# EAGLE design Charger Relay Board rev2 (EAGLE 9.5.0)
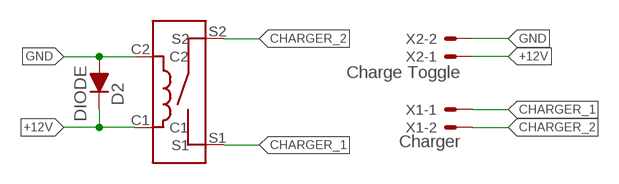
[diagram p0: schematic, sheet 1]

## Parts
D2  DIODE  DIODE0805  [0805_D]
U$1  KT12-1A-40L-THT  [KT12-1A-40L-THT]
X1  Charger  CONNECTOR-2  [MINIFIT_5566-2]
X2  Charge Toggle  CONNECTOR-2  [MINIFIT_5566-2]

## Nets
+12V: D2.C U$1.C1 X2.1
CHARGER_1: U$1.S1 X1.1
CHARGER_2: U$1.S2 X1.2
GND: D2.A U$1.C2 X2.2

## Library data of the parts
D2 = HyTechDevices:DIODE: DIODE general purpose rectifier
U$1 = HyTechDevices:KT12-1A-40L-THT
X1 X2 = HyTechDevices:CONNECTOR-2: Mini-Fit Junior connector 2 pole Source: http://www.molex.com; OC_FARNELL: 1822072; OC_NEWARK: unknown

## Board
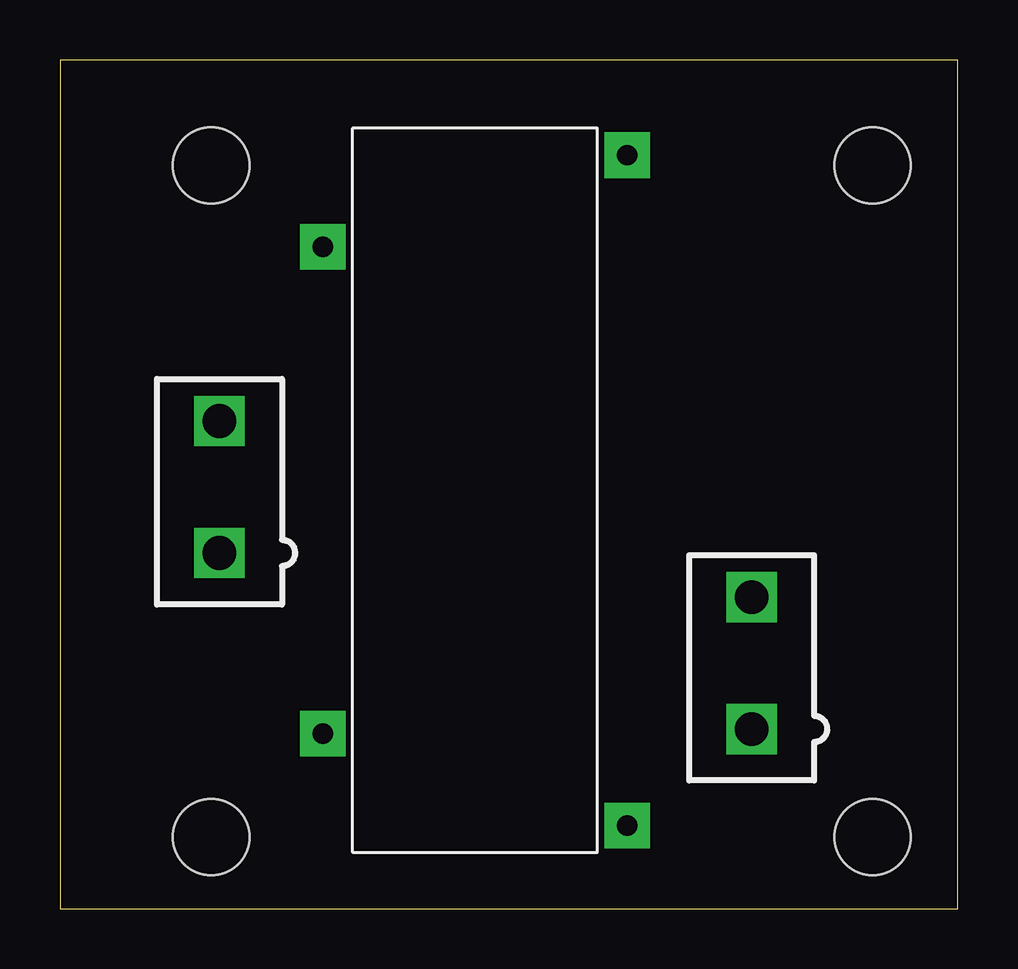
[diagram p1: board, top side]
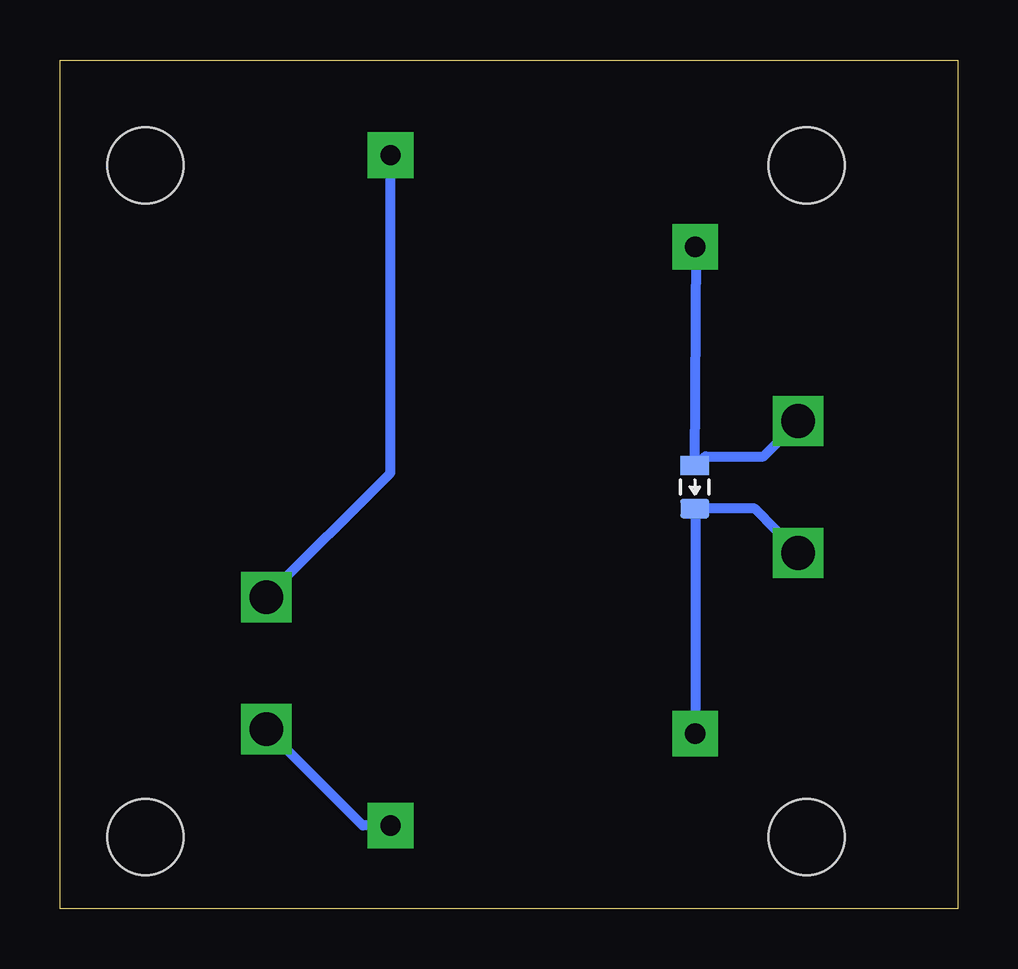
[diagram p2: board, bottom side, seen from below]

Size 37.43 x 35.39 mm. Coordinates in mm from the lower left corner, seen from the top.
Outline: 0,0 37.43,0 37.43,35.39 0,35.39 0,0
Copper layers (1*16): Top 0.035mm / dielectric 1.5mm / Bottom 0.035mm
Design rules "DRC Advanced Circuits": minimum track width 6mil, minimum drill 10mil, track to track 6mil, track to pad 6mil, pad to pad 6mil, via to via 6mil, smd to smd 6mil, copper to edge 40mil, drill to drill 6mil, minimum pad ring 10mil, minimum via ring 8mil, stop-mask expansion 4mil, vias tented up to drill 0mil, thermal gap 10mil
Holes 3.17 mm at 6.3,31 6.3,3 33.87,3 33.87,31

### Footprints (pad centres in the part's own frame; a part is rotated, then mirrored left to right if it is on the bottom)
0805_D = smd 0.8 x 1.2: A -0.9,0; C 0.9,0
KT12-1A-40L-THT = drill 0.85 pad 1.9 square: C1 4.95,11.45; C2 25.25,11.45; S1 1.13,-1.25; S2 29.07,-1.25
MINIFIT_5566-2 = drill 1.4 square: 1 0,-2.75; 2 0,2.75

### Placement (x,y rotation side)
D2  10.97,17.59 270 bottom
U$1  22.4,2.35 90 top
X1  28.83,10.25 0 top
X2  6.65,17.59 0 top

### Tracks (layer width: path | path; a pad name or v marks a point on that pad's centre or on a via)
+12V
  Bottom 0.406: X2.1 8.47,16.69 D2.C 10.95,16.63 U$1.C1
CHARGER_1
  Bottom 0.406: U$1.S1 24.81,3.48 X1.1
CHARGER_2
  Bottom 0.406: X1.2 23.65,18.18 U$1.S2
GND
  Bottom 0.406: U$1.C2 10.89,27.54 D2.A 10.52,18.86 8.1,18.86 X2.2

### Text on the board
tDocu: HyTech Racing 2020 | TOGGLE CHARGER | CHARGER | Charger Relay Board Rev2